# EAGLE schematic Scheme (EAGLE 7.2.0)
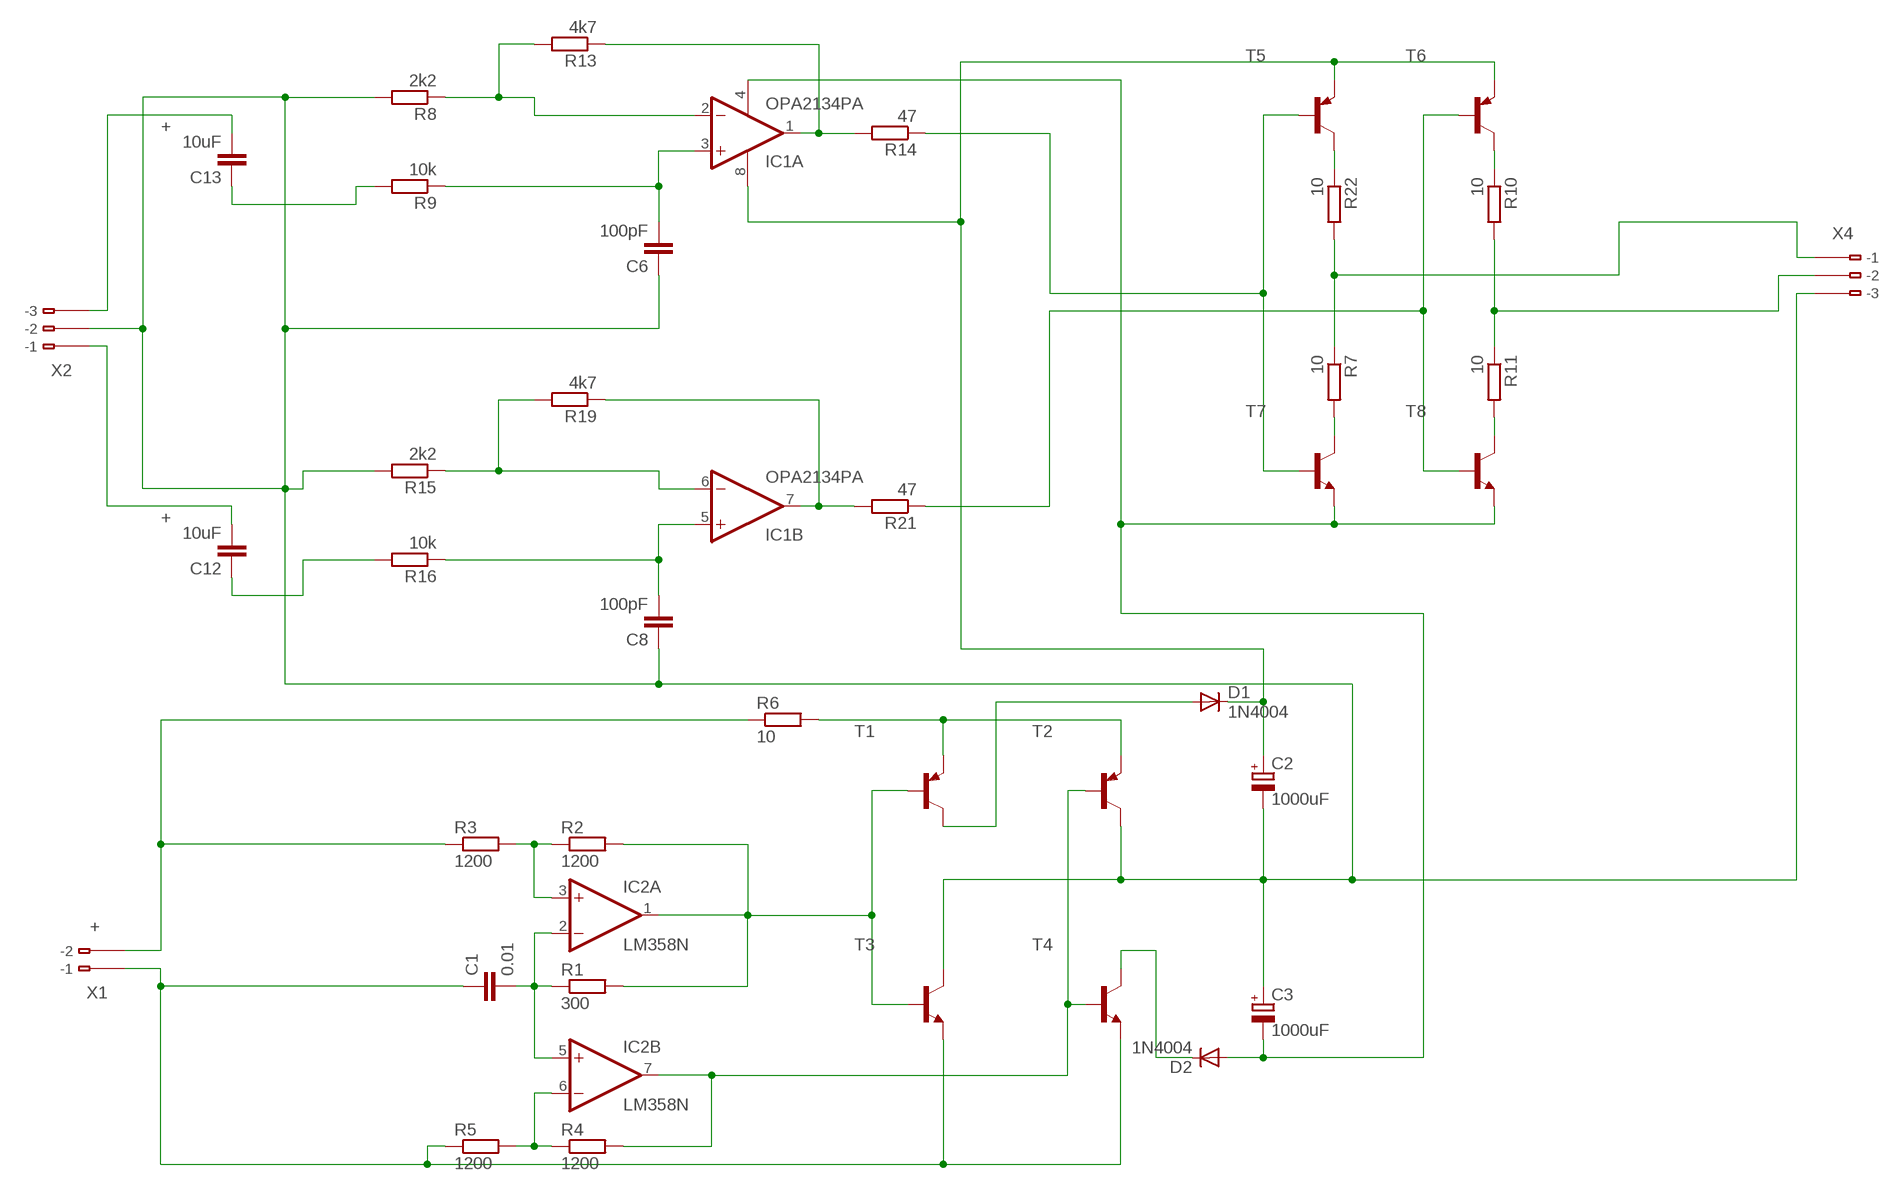
[diagram p0: schematic, sheet 1]

## Parts
C1  0.01  C-EU025-060X050  [C025-060X050]
C2  1000uF  CPOL-EU085CS-1AR  [085CS_1AR]
C3  1000uF  CPOL-EU085CS-1AR  [085CS_1AR]
C6  100pF  C-EU025-060X050  [C025-060X050]
C8  100pF  C-EU025-060X050  [C025-060X050]
C12  10uF  C-EU025-060X050  [C025-060X050]
C13  10uF  C-EU025-060X050  [C025-060X050]
D1  1N4004  [DO41-10]
D2  1N4004  [DO41-10]
IC1  OPA2134PA  [DIL08]
IC2  LM358N  [DIL08]
R1  300  R-EU_0204/2V  [0204V]
R2  1200  R-EU_0204/2V  [0204V]
R3  1200  R-EU_0204/2V  [0204V]
R4  1200  R-EU_0204/2V  [0204V]
R5  1200  R-EU_0204/2V  [0204V]
R6  10  R-EU_0204/2V  [0204V]
R7  10  R-EU_0204/2V  [0204V]
R8  2k2  R-EU_0204/2V  [0204V]
R9  10k  R-EU_0204/2V  [0204V]
R10  10  R-EU_0204/2V  [0204V]
R11  10  R-EU_0204/2V  [0204V]
R13  4k7  R-EU_0204/2V  [0204V]
R14  47  R-EU_0204/2V  [0204V]
R15  2k2  R-EU_0204/2V  [0204V]
R16  10k  R-EU_0204/2V  [0204V]
R19  4k7  R-EU_0204/2V  [0204V]
R21  47  R-EU_0204/2V  [0204V]
R22  10  R-EU_0204/2V  [0204V]
T1  2N4403-PNP-TO92-EBC  [TO92-EBC]
T2  2N4403-PNP-TO92-EBC  [TO92-EBC]
T3  2N4401-NPN-TO92-EBC  [TO92-EBC]
T4  2N4401-NPN-TO92-EBC  [TO92-EBC]
T5  2N4403-PNP-TO92-EBC  [TO92-EBC]
T6  2N4403-PNP-TO92-EBC  [TO92-EBC]
T7  2N4401-NPN-TO92-EBC  [TO92-EBC]
T8  2N4401-NPN-TO92-EBC  [TO92-EBC]
X1  233-102  [233-102]
X2  233-103  [233-103]
X4  233-103  [233-103]

## Nets
N$1: IC2.1(A:OUT) R1.2 R2.2 T1.B T3.B
N$2: IC2.3(A:+IN) R2.1 R3.2
N$3: R3.1 R6.1 X1.B2(B-2)
N$4: C1.2 IC2.2(A:-IN) IC2.5(B:+IN) R1.1
N$5: C1.1 R5.1 T3.E T4.E X1.B1(B-1)
N$6: C13.1 R9.2
N$7: IC2.7(B:OUT) R4.2 T2.B T4.B
N$8: D1.A T1.C
N$9: C12.2 X2.B1(B-1)
N$10: C2.- C3.+ C6.1 C8.1 R8.2 R15.2 T2.C T3.C X2.B2(B-2) X4.B3(B-3)
N$11: C3.- D2.A IC1.4(A:V-) T7.E T8.E
N$12: IC2.6(B:-IN) R4.1 R5.2
N$13: D2.C T4.C
N$14: IC1.2(A:-IN) R8.1 R13.2
N$15: R6.2 T1.E T2.E
N$16: C13.2 X2.B3(B-3)
N$17: C6.2 IC1.3(A:+IN) R9.1
N$18: R22.1 T5.C
N$20: IC1.1(A:OUT) R13.1 R14.2
N$21: IC1.6(B:-IN) R15.1 R19.2
N$22: R7.2 T7.C
N$23: C12.1 R16.2
N$24: C8.2 IC1.5(B:+IN) R16.1
N$25: R10.1 T6.C
N$27: R11.2 T8.C
N$28: IC1.7(B:OUT) R19.1 R21.2
N$29: R14.1 T5.B T7.B
N$30: R21.1 T6.B T8.B
N$33: C2.+ D1.C IC1.8(A:V+) T5.E T6.E
N$37: R7.1 R22.2 X4.B1(B-1)
N$38: R10.2 R11.1 X4.B2(B-2)
Unconnected: X1.A1(-1) X1.A2(-2) X2.A1(-1) X2.A2(-2) X2.A3(-3) X4.A1(-1) X4.A2(-2) X4.A3(-3)

## Notes on the sheet
- +
- +
- +

## Power pins joined to a net without a drawn wire
V+: IC2.8(P:V+)
V-: IC2.4(P:V-)

## Library data of the parts
C1 C6 C8 C12 C13 = resistor:C-EU: CAPACITOR, European symbol
C2 C3 = resistor:CPOL-EU: POLARIZED CAPACITOR, European symbol
D1 D2 = adafruit:1N4004: DIODE General purpose 1N400x type rectifier (With bigger pads) http://www.ladyada.net/library/pcb/eaglelibrary.html
IC1 = linear:OPA2*: Dual Operational Amplifier Low Power, Single-Supply, Rail-To-Rail Operational Amplifier Source: http://focus.ti.com/lit/ds/symlink/opa2345.pdf http://focus.ti.com .. opa241.pdf http://focus.ti.com/lit/ds/symlink/opa2134.pdf
IC2 = linear:LM358: OP AMP also LM158; LM258; LM2904 Source: http://cache.national.com/ds/LM/LM158.pdf
R1-R11 R13-R16 R19 R21 R22 = resistor:R-EU_: RESISTOR, European symbol
T1 T2 T5 T6 = transistor-neu-to92:*-PNP-: PNP Transistror
T3 T4 T7 T8 = transistor-neu-to92:*-NPN-: NPN Transistror
X1 = con-wago:233-102: WAGO Cage Clamp; MPN: 233-102; OC_FARNELL: unknown; OC_NEWARK: 28K9044
X2 X4 = con-wago:233-103: WAGO Cage Clamp; MPN: 233-103; OC_FARNELL: unknown; OC_NEWARK: 28K9045